# Altium project Audio-Beamformer.PrjPcb (part 2 of 2)

## Sheet Audio-Beamformer_USB_V1.0.SchDoc: Audio-Beamformer
size A4; PageSetup: Record=PageOptions|CenterHorizontal=True|CenterVertical=True|PrintScale=0.97|XCorrection=1.00|YCorrection=1.00|PrintKind=0|BorderSize=5000000|LeftOffset=0|BottomOffset=0|Orientation=2|PaperLength=1000|PaperWidth=1000|Scale=100|PaperSource=7|PrintQuality=-3|MediaType=1|DitherType=10|PrintScaleMode=1|PaperKind=A4|PaperIndex=9; Organization: Ostschweizer Fachhochschule; Address2: Florian Baumgartner & Thierry Schwaller; Address3: florian.baumgartner@ost.ch; DocumentNumber: 7; Revision: V1.0; SheetNumber: 7; SheetTotal: 10; Author: Florian Baumgartner & Thierry Schwaller; Subtitle: USB
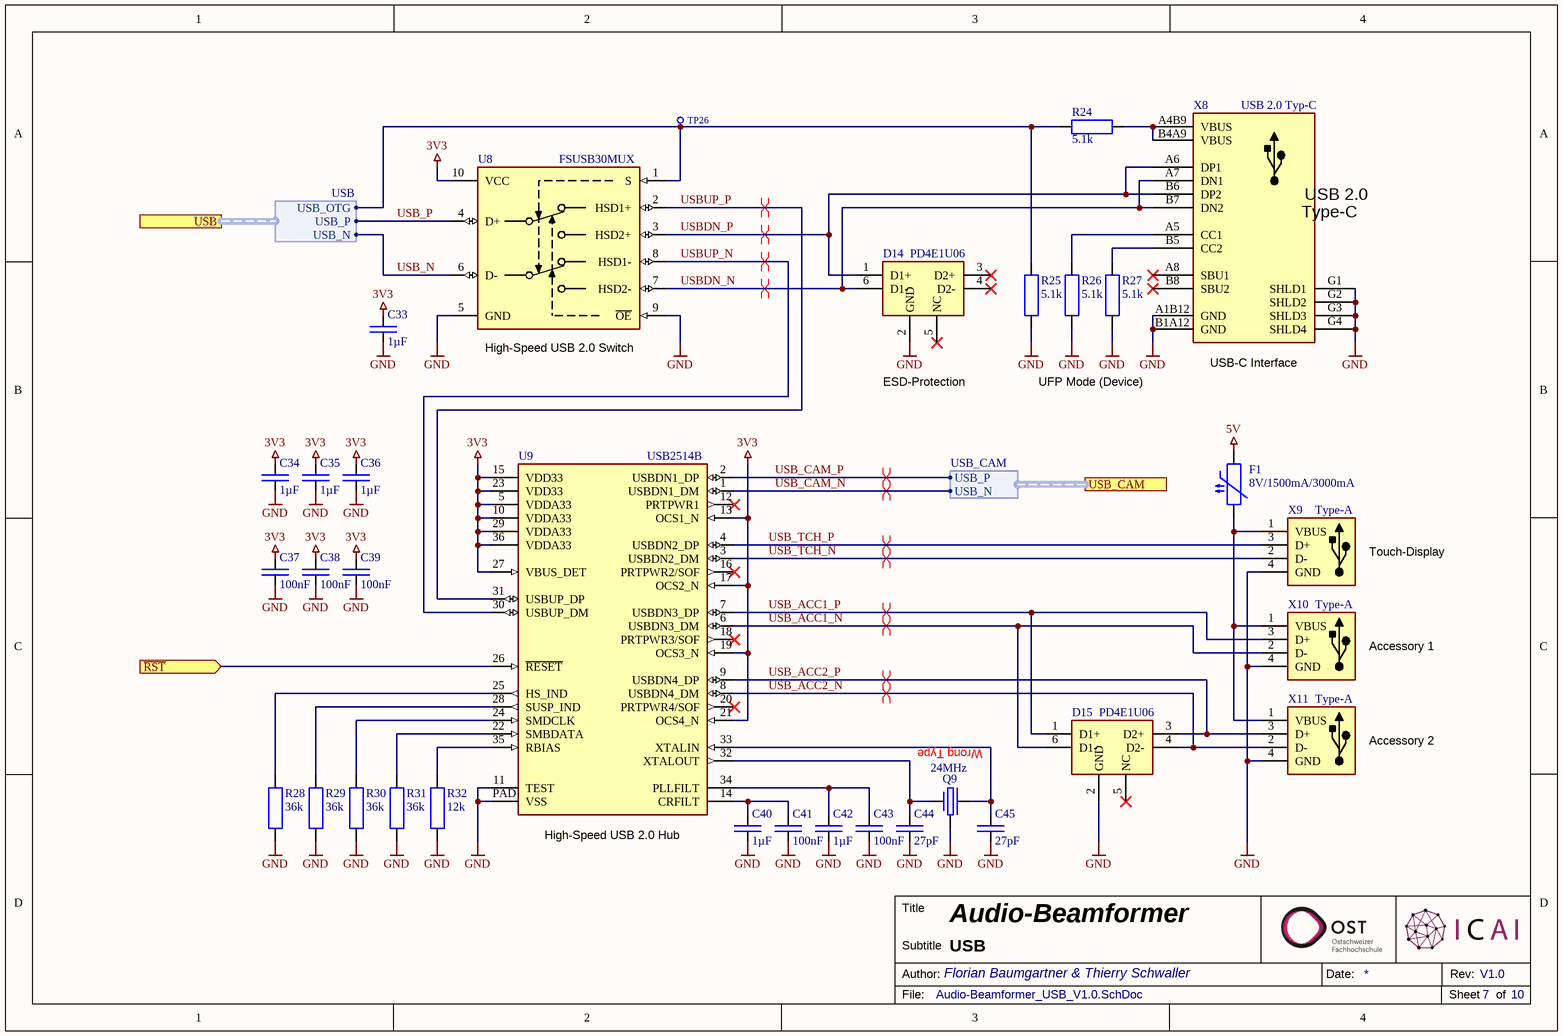
[diagram p5: Audio-Beamformer_USB_V1.0.SchDoc]

### Parts
C33  1µF  [SMD Keramikkondensator 0603]
C34  1µF  [SMD Keramikkondensator 0603]
C35  1µF  [SMD Keramikkondensator 0603]
C36  1µF  [SMD Keramikkondensator 0603]
C37  100nF  [SMD Keramikkondensator 0603]
C38  100nF  [SMD Keramikkondensator 0603]
C39  100nF  [SMD Keramikkondensator 0603]
C40  1µF  [SMD Keramikkondensator 0603]
C41  100nF  [SMD Keramikkondensator 0603]
C42  1µF  [SMD Keramikkondensator 0603]
C43  100nF  [SMD Keramikkondensator 0603]
C44  27pF  [SMD Keramikkondensator 0603]
C45  27pF  [SMD Keramikkondensator 0603]
D14  PD4E1U06  [SMD IC SOT-363 (SC-70-6)]
D15  PD4E1U06  [SMD IC SOT-363 (SC-70-6)]
F1  8V/1500mA/3000mA  [SMD PPTC-Fuse 1206]
Q9  24MHz  [SMD Crystal 3.2X2.5X0.8]
R24  5.1k  [SMD Widerstand 0603]
R25  5.1k  [SMD Widerstand 0603]
R26  5.1k  [SMD Widerstand 0603]
R27  5.1k  [SMD Widerstand 0603]
R28  36k  [SMD Widerstand 0603]
R29  36k  [SMD Widerstand 0603]
R30  36k  [SMD Widerstand 0603]
R31  36k  [SMD Widerstand 0603]
R32  12k  [SMD Widerstand 0603]
TP26  X-TP  [THT Testpunkt Ø1mm]  (value not drawn)  (no BOM)
U8  FSUSB30MUX  [SMD IC MSOP-10]
U9  USB2514B  [SMD IC VFQFN-36]
X8  USB 2.0 Typ-C  [SMD USB-C Socket (A40-00119)]
X9  Type-A  [THT USB-A (292303-1)]
X10  Type-A  [THT USB-A (292303-1)]
X11  Type-A  [THT USB-A (292303-1)]

### Ports
USB (harness USB), USB_CAM (harness USB_CAM), ~{RST} (in)

### Harnesses
USB_CAM: USB_N, USB_P
USB: USB_N, USB_P, USB_OTG

### Nets
3V3: C33.2 C34.2 C35.2 C36.2 C37.2 C38.2 C39.2 U8.10(VCC) U9.5(VDDA33) U9.10(VDDA33) U9.13(OCS1_N) U9.15(VDD33) U9.17(OCS2_N) U9.19(OCS3_N) U9.21(OCS4_N) U9.23(VDD33) U9.27(VBUS_DET) U9.29(VDDA33) U9.36(VDDA33)  [project net A17]
5V: F1.2
GND: C33.1 C34.1 C35.1 C36.1 C37.1 C38.1 C39.1 C40.1 C41.1 C42.1 C43.1 C44.2 C45.2 D14.2(GND) D15.2(GND) Q9.3 R25.2 R26.2 R27.2 R28.1 R29.1 R30.1 R31.1 R32.1 U8.5(GND) U8.9(~{OE}) U9.11(TEST) U9.PAD(VSS) X8.A1B12(GND) X8.B1A12(GND) X8.G1(SHLD1) X8.G2(SHLD2) X8.G3(SHLD3) X8.G4(SHLD4) X9.4(GND) X10.4(GND) X11.4(GND)  [project net A14]
D39: U9.26(~{RESET}) ; port ~{RST}
USB_ACC1_N: D15.6(D1-) U9.6(USBDN3_DM) X10.2(D-)
USB_ACC1_P: D15.1(D1+) U9.7(USBDN3_DP) X10.3(D+)
USB_ACC2_N: D15.4(D2-) U9.8(USBDN4_DM) X11.2(D-)
USB_ACC2_P: D15.3(D2+) U9.9(USBDN4_DP) X11.3(D+)
USB_CAM_N: U9.1(USBDN1_DM) ; port USB_CAM.USB_N
USB_CAM_P: U9.2(USBDN1_DP) ; port USB_CAM.USB_P
USB_N: U8.6(D-) ; port USB.USB_N
USB_OTG: R24.1 R25.1 TP26.1 U8.1(NC) ; port USB.USB_OTG
USB_P: U8.4(D+) ; port USB.USB_P
USB_TCH_N: U9.3(USBDN2_DM) X9.2(D-)
USB_TCH_P: U9.4(USBDN2_DP) X9.3(D+)
USBDN_N: D14.6(D1-) U8.7(HSD2-) X8.A7(DN1) X8.B7(DN2)
USBDN_P: D14.1(D1+) U8.3(HSD2+) X8.A6(DP1) X8.B6(DP2)
USBUP_N: U8.8(HSD1-) U9.30(USBUP_DM)
USBUP_P: U8.2(HSD1+) U9.31(USBUP_DP)
NetC40_2: C40.2 C41.2 U9.14(CRFILT)
NetC42_2: C42.2 C43.2 U9.34(PLLFILT)
NetC44_1: C44.1 Q9.1 U9.32(XTALOUT)
NetC45_1: C45.1 Q9.2 U9.33(XTALIN)
NetF1_1: F1.1 X9.1(VBUS) X10.1(VBUS) X11.1(VBUS)
NetR24_2: R24.2 X8.A4B9(VBUS) X8.B4A9(VBUS)
NetR26_1: R26.1 X8.A5(CC1)
NetR27_1: R27.1 X8.B5(CC2)
NetR28_2: R28.2 U9.25(HS_IND)
NetR29_2: R29.2 U9.28(SUSP_IND)
NetR30_2: R30.2 U9.24(SMDCLK)
NetR31_2: R31.2 U9.22(SMBDATA)
NetR32_2: R32.2 U9.35(RBIAS)

Not connected (* = marked no-connect by the designer): D14 3(D2+)* 4(D2-)* 5(NC)*; D15 5(NC)*; U9 12(PRTPWR1)* 16(PRTPWR2/SOF)* 18(PRTPWR3/SOF)* 20(PRTPWR4/SOF)*; X8 A8(SBU1)* B8(SBU2)*

### Layout directives
differential pair: USB_ACC1_N, USB_ACC1_P, USB_ACC2_N, USB_ACC2_P, USB_CAM_N, USB_CAM_P, USB_TCH_N, USB_TCH_P, USBDN_N, USBDN_P, USBUP_N, USBUP_P

### Notes on the sheet
- (near U8) High-Speed USB 2.0 Switch
- ESD-Protection
- UFP Mode (Device)
- (near X8) USB-C Interface
- Touch-Display
- Accessory 1
- (near Q9) Wrong Type
- Accessory 2
- (near U9) High-Speed USB 2.0 Hub
- Title
- Author:
- Subtitle
- Date:
- Rev:
- File:
- Sheet
- of
- (in symbol X-USB-Buchse) USB 2.0; Type-C

### Library data of the parts
C33-C36 C40 C42 = E6 - 1uF: SMD Ceramic Capacitor E6; Component Value: 1µF 50V; Component Description: Multilayer Ceramic Capacitors MLCC; ComponentLink1Description: Datasheet; ComponentLink1URL: https://datasheet.lcsc.com/lcsc/1810261812_Samsung-Electro-Mechanics-CL10A105KB8NNNC_C15849.pdf; Digikey: 1276-1860-1-ND; Farnell: 3013383; JLC-Parts: C15849; Mouser: 187-CL10A105KB8NNNC; Unit Price: 0.01
C37-C39 C41 C43 = C-CAPACITOR: CAP-MK; Component Description: Multilayer Ceramic Capacitors; Component Value: 100nF 50V; Digikey: 445-5666-1-ND; Farnell: 2522432; Mouser: 77-VJ0603V104ZXAPBC; JLC-Parts: C14663; Unit Price: 0.01
C44 C45 = C-CAPACITOR: CAP-MK; Component Description: Multilayer Ceramic Capacitors; Component Value: 27pF 50V; Digikey: 399-C0603C270J5GAC7867CT-ND; Farnell: 1414627; Mouser: 80-C0603C270J5G; JLC-Parts: C1656; Unit Price: 0.01
D14 D15 = PD4E1U06DCKR: Unidirectional 3A (8/20us) 15V (Typ) 6.5V 5.5V (Max) SOT-363 ESD Protection Devices ROHS; Component Description: ESD Suppressor; ComponentLink1Description: Datasheet; ComponentLink1URL: https://datasheet.lcsc.com/lcsc/1810172210_Texas-Instruments-TPD4E1U06DCKR_C194628.pdf; Component Value: PD4E1U06; Digikey: 296-39347-1-ND; Farnell: 3116516; JLC-Parts: C194628; Mouser: 595-TPD4E1U06DCKR; Unit Price: 0.12
F1 = nSMD020-30V: 8V/1500mA/3000mA Resettable Fuses; Component Value: 8V/1500mA/3000mA/100ms; Component Description: PTC Resettable Fuse; ComponentLink1Description: Datasheet; ComponentLink1URL: https://www.littelfuse.com/~/media/electronics/datasheets/resettable_ptcs/littelfuse_ptc_1206l_datasheet.pdf.pdf; Digikey: F3372CT-ND; Farnell: 2383296; JLC-Parts: C118413; Mouser: 576-1206L150THWR; Unit Price: 0.07
Q9 = B-QUARZ-CAP: Component Description: Crystal; Digikey: XC2310CT-ND; Farnell: 3649756; Mouser: 520-240-18-33-JGNT; ComponentLink1Description: Datasheet; ComponentLink1URL: https://datasheet.lcsc.com/lcsc/1810170919_TKD-SX32Y024000BC1T_C271629.pdf; Component Value: 24Mhz; JLC-Parts: C271629; Unit Price: 0.11
R24-R27 = R-RESISTOR: RES (E=Heizwiderstand B=Messwandler); Component Description: Thick Film Chip Resistor; Component Value: 5.1k (75V, 100mW, 1%); Digikey: P5.10KHCT-ND; Farnell: 2059378; Mouser: 667-ERJ-3EKF5101V; JLC-Parts: C23186; Unit Price: 0.01
R28-R31 = R-RESISTOR: RES (E=Heizwiderstand B=Messwandler); Component Description: Thick Film Chip Resistor; Component Value: 36k (75V, 100mW, 1%); Digikey: P36.0KHCT-ND; Farnell: 2303207; Mouser: 667-ERJ-3EKF3602V; JLC-Parts: C23147; Unit Price: 0.01
R32 = R-RESISTOR: RES (E=Heizwiderstand B=Messwandler); Component Description: Thick Film Chip Resistor; Component Value: 12k (75V, 100mW, 1%); Digikey: P12.0KHCT-ND; Farnell: 2303195; Mouser: 667-ERJ-3EKF1202V; JLC-Parts: C22790; Unit Price: 0.01
TP26 = X-TP: Testpunkt; Component Description: Testpoint; Component Value: Ø 0.8mm; Unit Price: 0.00
U8 = U-FSUSB30MUX: High Speed USB 2.0 Switch; Digikey: FSUSB30MUXCT-ND; Farnell: 1495465; Mouser: 512-FSUSB30MUX; Component Description: High Speed USB 2.0 Switch; ComponentLink1Description: Datasheet; ComponentLink1URL: https://datasheet.lcsc.com/lcsc/1809111813_onsemi-FSUSB30MUX_C11143.pdf; Component Value: FSUSB30MUX; JLC-Parts: C11143; Unit Price: 0.41
U9 = U-USB2514B: USB 2.0 Hi-Speed Hub Controller; Component Value: USB2514B-AEZC-TR; Digikey: USB2514B-AEZC-CT-ND; Farnell: 2775061; Mouser: 886-USB2514B-AEZC-TR; Component Description: USB 2.0 Hi-Speed Hub Controller; ComponentLink1Description: Datasheet; ComponentLink1URL: https://datasheet.lcsc.com/lcsc/1809200030_Microchip-Tech-USB2514B-AEZC-TR_C16251.pdf; JLC-Parts: C16251; Unit Price: 6.37
X8 = X-USB-Buchse: Typ-C; aliExpress: 33045191307; Component Description: USB Connector Type-C; Component Value: USB4105-GF-A; Digikey: 2073-USB4105-GF-ACT-ND; Farnell: 3583366; ComponentLink1Description: Datasheet; ComponentLink1URL: https://datasheet.lcsc.com/lcsc/2103051833_Jing-Extension-of-the-Electronic-Co--918-418K2023S40001_C167321.pdf; JLC-Parts: C167321; Unit Price: 0.34
X9-X11 = X-USB-Type-A: Component Value: 292303-1; Component Description: USB Connector Type-A; Digikey: A31726-ND; Farnell: 1076663; Mouser: 571-292303-1; Unit Price: 0.45; ComponentLink1Description: Datasheet; ComponentLink1URL: https://datasheet.lcsc.com/lcsc/1811131820_TE-Connectivity-292303-1_C86461.pdf; JLC-Parts: C86461

## Sheet Audio-Beamformer_HDMI_V1.0.SchDoc: Audio-Beamformer
size A4; PageSetup: Record=PageOptions|CenterHorizontal=True|CenterVertical=True|PrintScale=0.97|XCorrection=1.00|YCorrection=1.00|PrintKind=0|BorderSize=5000000|LeftOffset=0|BottomOffset=0|Orientation=2|PaperLength=1000|PaperWidth=1000|Scale=100|PaperSource=7|PrintQuality=-3|MediaType=1|DitherType=10|PrintScaleMode=1|PaperKind=A4|PaperIndex=9; Organization: Ostschweizer Fachhochschule; Address2: Florian Baumgartner & Thierry Schwaller; Address3: florian.baumgartner@ost.ch; DocumentNumber: 6; Revision: V1.0; SheetNumber: 6; SheetTotal: 10; Author: Florian Baumgartner & Thierry Schwaller; Subtitle: HDMI
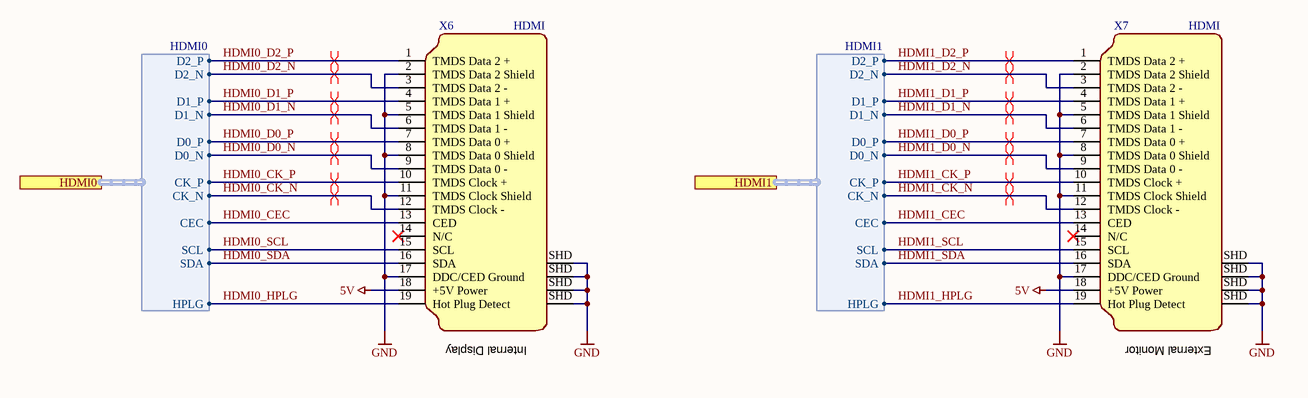
[diagram p6: Audio-Beamformer_HDMI_V1.0.SchDoc]

### Parts
X6  HDMI  [SMD HDMI Horizontal]
X7  HDMI  [SMD HDMI Horizontal]

### Ports
HDMI0 (harness HDMI0), HDMI1 (harness HDMI1)

### Harnesses
HDMI1: D2_N, D1_P, D2_P, D1_N, D0_P, D0_N, CK_N, CK_P, CEC, SCL, SDA, HPLG
HDMI0: D2_N, D1_P, D2_P, D1_N, D0_P, D0_N, CK_N, CK_P, CEC, SCL, SDA, HPLG

### Nets
5V: X6.18(+5V_Power) X7.18(+5V_Power)
GND: X6.2(TMDS_Data_2_Shield) X6.5(TMDS_Data_1_Shield) X6.8(TMDS_Data_0_Shield) X6.11(TMDS_Clock_Shield) X6.17(DDC/CED_Ground) X6.SHD X7.2(TMDS_Data_2_Shield) X7.5(TMDS_Data_1_Shield) X7.8(TMDS_Data_0_Shield) X7.11(TMDS_Clock_Shield) X7.17(DDC/CED_Ground) X7.SHD  [project net A14]
HDMI0_CEC: X6.13(CED) ; port HDMI0.CEC
HDMI0_CK_N: X6.12(TMDS_Clock_-) ; port HDMI0.CK_N
HDMI0_CK_P: X6.10(TMDS_Clock_+) ; port HDMI0.CK_P
HDMI0_D0_N: X6.9(TMDS_Data_0_-) ; port HDMI0.D0_N
HDMI0_D0_P: X6.7(TMDS_Data_0_+) ; port HDMI0.D0_P
HDMI0_D1_N: X6.6(TMDS_Data_1_-) ; port HDMI0.D1_N
HDMI0_D1_P: X6.4(TMDS_Data_1_+) ; port HDMI0.D1_P
HDMI0_D2_N: X6.3(TMDS_Data_2_-) ; port HDMI0.D2_N
HDMI0_D2_P: X6.1(TMDS_Data_2_+) ; port HDMI0.D2_P
HDMI0_HPLG: X6.19(Hot_Plug_Detect) ; port HDMI0.HPLG
HDMI0_SCL: X6.15(SCL) ; port HDMI0.SCL
HDMI0_SDA: X6.16(SDA) ; port HDMI0.SDA
HDMI1_CEC: X7.13(CED) ; port HDMI1.CEC
HDMI1_CK_N: X7.12(TMDS_Clock_-) ; port HDMI1.CK_N
HDMI1_CK_P: X7.10(TMDS_Clock_+) ; port HDMI1.CK_P
HDMI1_D0_N: X7.9(TMDS_Data_0_-) ; port HDMI1.D0_N
HDMI1_D0_P: X7.7(TMDS_Data_0_+) ; port HDMI1.D0_P
HDMI1_D1_N: X7.6(TMDS_Data_1_-) ; port HDMI1.D1_N
HDMI1_D1_P: X7.4(TMDS_Data_1_+) ; port HDMI1.D1_P
HDMI1_D2_N: X7.3(TMDS_Data_2_-) ; port HDMI1.D2_N
HDMI1_D2_P: X7.1(TMDS_Data_2_+) ; port HDMI1.D2_P
HDMI1_HPLG: X7.19(Hot_Plug_Detect) ; port HDMI1.HPLG
HDMI1_SCL: X7.15(SCL) ; port HDMI1.SCL
HDMI1_SDA: X7.16(SDA) ; port HDMI1.SDA

Not connected (* = marked no-connect by the designer): X6 14(N/C)*; X7 14(N/C)*

### Layout directives
differential pair: HDMI0_CK_N, HDMI0_CK_P, HDMI0_D0_N, HDMI0_D0_P, HDMI0_D1_N, HDMI0_D1_P, HDMI0_D2_N, HDMI0_D2_P, HDMI1_CK_N, HDMI1_CK_P, HDMI1_D0_N, HDMI1_D0_P, HDMI1_D1_N, HDMI1_D1_P, HDMI1_D2_N, HDMI1_D2_P

### Notes on the sheet
- (near X6) Internal Display
- (near X7) External Monitor
- Title
- Author:
- Subtitle
- Date:
- Rev:
- File:
- Sheet
- of

### Library data of the parts
X6 X7 = X-HDMI-Connector: Female Right Angle; Component Description: HDMI-Connector (Female Right Angle); Component Value: HDMR-19-01-S-SM; Digikey: SAM9475-ND; Farnell: 3742389; Mouser: 200-HDMR-19-01-SSMTR; ComponentLink1Description: Datasheet; ComponentLink1URL: https://datasheet.lcsc.com/lcsc/1811111311_BOOMELE-Boom-Precision-Elec-C138388_C138388.pdf; JLC-Parts: C138388; Unit Price: 0.21

## Sheet Audio-Beamformer_Sensors_V1.0.SchDoc: Audio-Beamformer
size A4; PageSetup: Record=PageOptions|CenterHorizontal=True|CenterVertical=True|PrintScale=0.97|XCorrection=1.00|YCorrection=1.00|PrintKind=0|BorderSize=5000000|LeftOffset=0|BottomOffset=0|Orientation=2|PaperLength=1000|PaperWidth=1000|Scale=100|PaperSource=7|PrintQuality=-3|MediaType=1|DitherType=10|PrintScaleMode=1|PaperKind=A4|PaperIndex=9; Organization: Ostschweizer Fachhochschule; Address2: Florian Baumgartner & Thierry Schwaller; Address3: florian.baumgartner@ost.ch; DocumentNumber: 10; Revision: V1.0; SheetNumber: 10; SheetTotal: 10; Author: Florian Baumgartner & Thierry Schwaller; Subtitle: Sensors
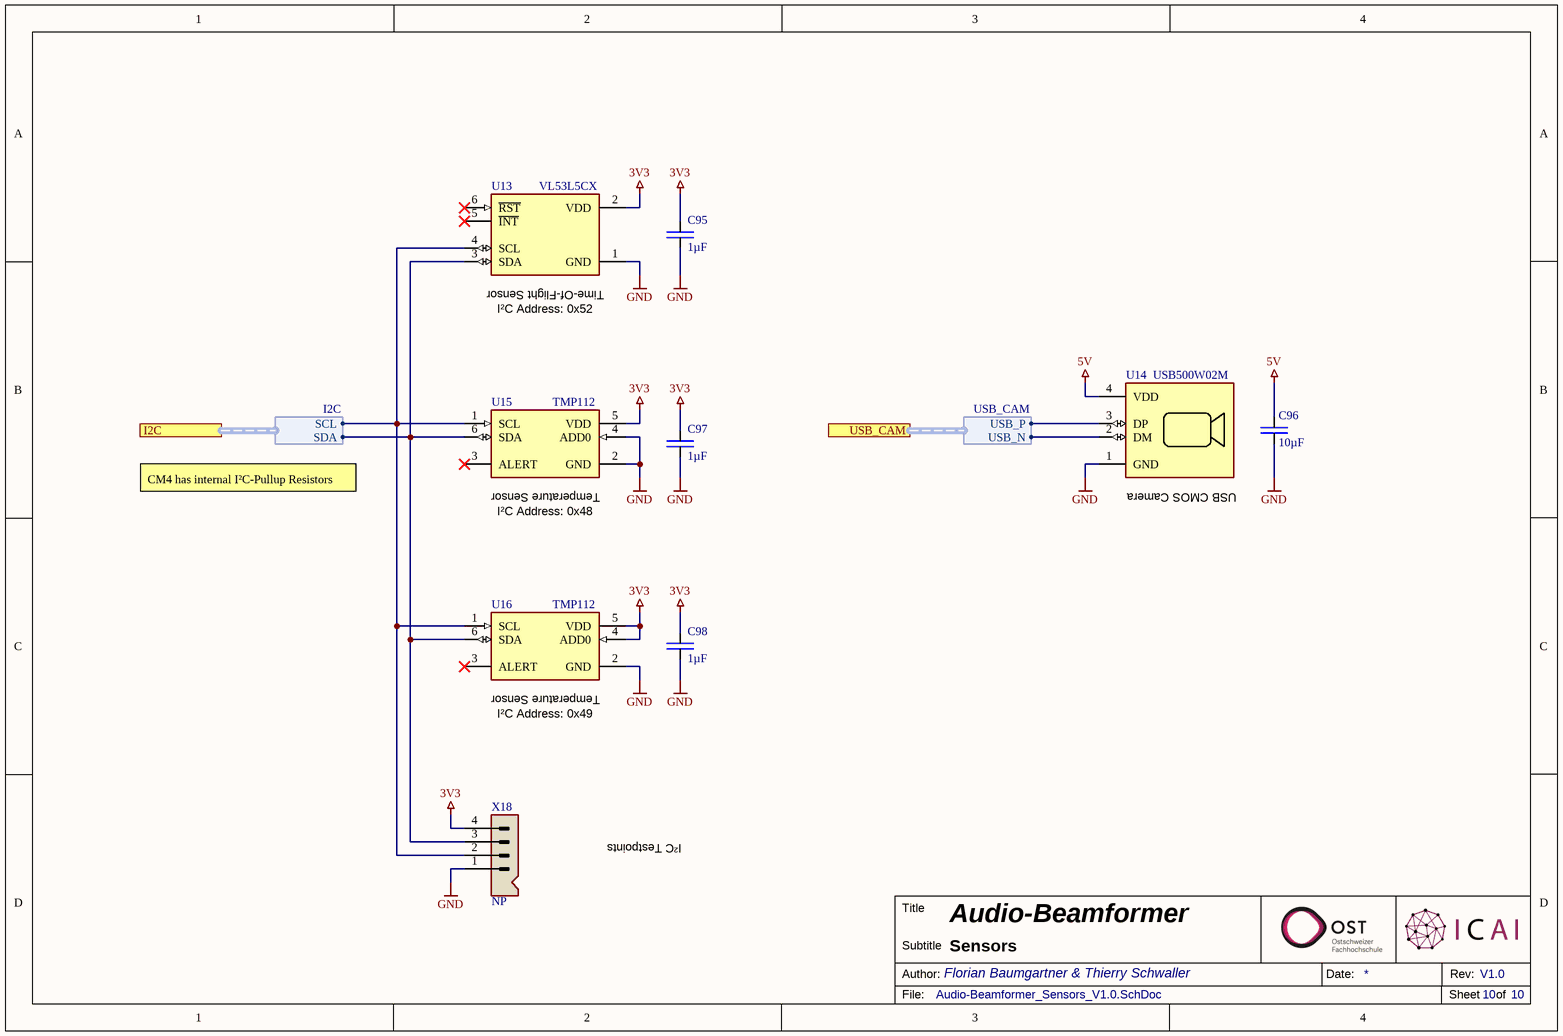
[diagram p7: Audio-Beamformer_Sensors_V1.0.SchDoc]

### Parts
C95  1µF  [SMD Keramikkondensator 0603]
C96  10µF  [SMD Keramikkondensator 1206]
C97  1µF  [SMD Keramikkondensator 0603]
C98  1µF  [SMD Keramikkondensator 0603]
U13  VL53L5CX  [THT ToF-Sensor (VL53L5CX)]
U14  USB500W02M  [THT Camera (USB500W02M)]
U15  TMP112  [SMD IC SOT-563]
U16  TMP112  [SMD IC SOT-563]
X18  NP  [THT Pin-Header 4x1 (NP)]

### Ports
I2C (harness I2C), USB_CAM (harness USB_CAM)

### Harnesses
I2C: SCL, SDA
USB_CAM: USB_N, USB_P

### Nets
3V3: C95.2 C97.2 C98.2 U13.2(VDD) U15.5(VDD) U16.4(ADD0) U16.5(VDD) X18.4  [project net A17]
5V: C96.2 U14.4(VDD)
GND: C95.1 C96.1 C97.1 C98.1 U13.1(GND) U14.1(GND) U15.2(GND) U15.4(ADD0) U16.2(GND) X18.1  [project net A14]
USB_CAM_N: U14.2(DM) ; port USB_CAM.USB_N
USB_CAM_P: U14.3(DP) ; port USB_CAM.USB_P
NetU5_80: U13.4(SCL) U15.1(SCL) U16.1(SCL) X18.2 ; port I2C.SCL
NetU5_82: U13.3(SDA) U15.6(SDA) U16.6(SDA) X18.3 ; port I2C.SDA

Not connected (* = marked no-connect by the designer): U13 5(~{INT})* 6(~{RST})*; U15 3(ALERT)*; U16 3(ALERT)*

### Notes on the sheet
- (near U13) Time-Of-Flight Sensor
- (near U13) I²C Address: 0x52
- CM4 has internal I²C-Pullup Resistors
- (near U15) Temperature Sensor
- (near U15) I²C Address: 0x48
- (near U14) USB CMOS Camera
- (near U16) Temperature Sensor
- (near U16) I²C Address: 0x49
- (near X18) I²C Testpoints
- Title
- Author:
- Subtitle
- Date:
- Rev:
- File:
- Sheet
- of

### Library data of the parts
C95 C97 C98 = C-CAPACITOR: CAP-MK; Component Description: Multilayer Ceramic Capacitors; Component Value: 1µF 16V; Digikey: 587-1251-1-ND; Farnell: 1327680; Mouser: 963-EMK107BJ105KA-T; JLC-Parts: C15849; Unit Price: 0.01
C96 = C-CAPACITOR: as C2 on sheet Audio-Beamformer_Supply_V1.0; Digikey: 445-7886-1-ND; Farnell: 2211092; Mouser: 810-CGA5L3X5R1H106K; JLC-Parts: C13585; Unit Price: 0.27
U13 = U-VL53L5CX: Time-of-Flight 8x8 Multizone Sensor; ComponentLink1Description: Datasheet; ComponentLink1URL: https://www.st.com/resource/en/datasheet/vl53l5cx.pdf; Digikey: 1568-SEN-19013-ND; Component Value: VL53L5CX; Mouser: 474-SEN-19013; Unit Price: 22.95; Component Description: Time-of-Flight 8x8 Multizone Sensor
U14 = U-USB500W02M: USB 5.0 Megapixel CMOS Camera Module; ComponentLink1Description: Datasheet; ComponentLink1URL: http://chinavasion.cn/upfile/2017/11/17/20171117105421_537.pdf; Component Description: USB 5.0 Megapixel CMOS Camera Module; Component Value: USB500W02M; Unit Price: 40.00
U15 U16 = U-TMP112AIDRLR: High-Accuracy, Low-Power, Digital Temperature Sensor; Digikey: 296-38578-1-ND; Farnell: 3009067; JLC-Parts: C28927; Mouser: 595-TMP112AIDRLR; ComponentLink1Description: Datasheet; ComponentLink1URL: https://www.ti.com/general/docs/suppproductinfo.tsp?distId=10&gotoUrl=https%3A%2F%2Fwww.ti.com%2Flit%2Fgpn%2Ftmp112; Component Description: High-Accuracy, Low-Power, Digital Temperature Sensor; Component Value: TMP112AIDRLR; Unit Price: 1.79
X18 = X-Stiftleiste (4-Fach): Component Description: Pin Header; Unit Price: 0.00

## Sheet Audio-Beamformer_FPGA_V1.0.SchDoc: Audio-Beamformer
size A4; PageSetup: Record=PageOptions|CenterHorizontal=True|CenterVertical=True|PrintScale=0.97|XCorrection=1.00|YCorrection=1.00|PrintKind=0|BorderSize=5000000|LeftOffset=0|BottomOffset=0|Orientation=2|PaperLength=1000|PaperWidth=1000|Scale=100|PaperSource=7|PrintQuality=-3|MediaType=1|DitherType=10|PrintScaleMode=1|PaperKind=A4|PaperIndex=9; Organization: Ostschweizer Fachhochschule; Address2: Florian Baumgartner & Thierry Schwaller; Address3: florian.baumgartner@ost.ch; DocumentNumber: 4; Revision: V1.0; SheetNumber: 4; SheetTotal: 10; Author: Florian Baumgartner & Thierry Schwaller; Subtitle: FPGA
Used 2 times, as channels FPGA, FPGA. Parts and nets are listed once, with the designators drawn on the sheet.
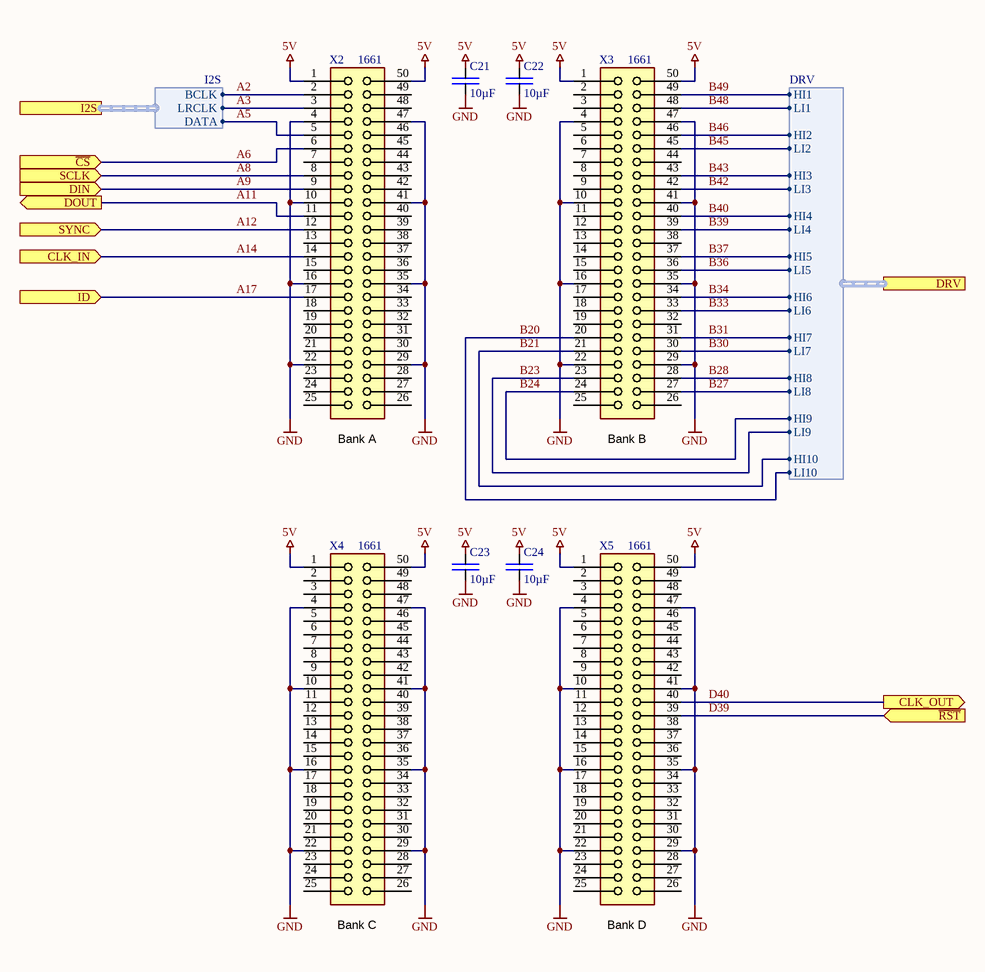
[diagram p8: Audio-Beamformer_FPGA_V1.0.SchDoc]

### Parts
C21  10µF  [SMD Keramikkondensator 1206]
C22  10µF  [SMD Keramikkondensator 1206]
C23  10µF  [SMD Keramikkondensator 1206]
C24  10µF  [SMD Keramikkondensator 1206]
X2  1661  [SMD Connector (1661)]
X3  1661  [SMD Connector (1661)]
X4  1661  [SMD Connector (1661)]
X5  1661  [SMD Connector (1661)]

### Ports
CLK_IN (in), CLK_OUT (out), DIN (in), DOUT (out), DRV (harness DRV), I2S (harness I2S), ID (in), SCLK (in), SYNC (in), ~{CS} (in), ~{RST} (in)

### Harnesses
I2S: BCLK, LRCLK, DATA
DRV: LI1, LI2, LI3, LI4, LI5, LI6, LI7, LI8, LI9, LI10, HI1, HI2, HI3, HI4, HI5, HI6, HI7, HI8, HI9, HI10

### Nets
5V: C21.2 C22.2 C23.2 C24.2 X2.1 X2.50 X3.1 X3.50 X4.1 X4.50 X5.1 X5.50
GND: C21.1 C22.1 C23.1 C24.1 X2.4 X2.10 X2.16 X2.22 X2.29 X2.35 X2.41 X2.47 X3.4 X3.10 X3.16 X3.22 X3.29 X3.35 X3.41 X3.47 X4.4 X4.10 X4.16 X4.22 X4.29 X4.35 X4.41 X4.47 X5.4 X5.10 X5.16 X5.22 X5.29 X5.35 X5.41 X5.47
A2: X2.2 ; port I2S.BCLK
A3: X2.3 ; port I2S.LRCLK
A5: X2.5 ; port I2S.DATA
A6: X2.6 ; port ~{CS}
A8: X2.8 ; port SCLK
A9: X2.9 ; port DIN
A11: X2.11 ; port DOUT
A12: X2.12 ; port SYNC
A14: X2.14 ; port CLK_IN
A17: X2.17 ; port ID
B20: X3.20 ; port DRV.LI10
B21: X3.21 ; port DRV.HI10
B23: X3.23 ; port DRV.LI9
B24: X3.24 ; port DRV.HI9
B27: X3.27 ; port DRV.LI8
B28: X3.28 ; port DRV.HI8
B30: X3.30 ; port DRV.LI7
B31: X3.31 ; port DRV.HI7
B33: X3.33 ; port DRV.LI6
B34: X3.34 ; port DRV.HI6
B36: X3.36 ; port DRV.LI5
B37: X3.37 ; port DRV.HI5
B39: X3.39 ; port DRV.LI4
B40: X3.40 ; port DRV.HI4
B42: X3.42 ; port DRV.LI3
B43: X3.43 ; port DRV.HI3
B45: X3.45 ; port DRV.LI2
B46: X3.46 ; port DRV.HI2
B48: X3.48 ; port DRV.LI1
B49: X3.49 ; port DRV.HI1
D39: X5.39 ; port ~{RST}
D40: X5.40 ; port CLK_OUT

Not connected (* = marked no-connect by the designer): X2 7 13 15 18 19 20 21 23 24 25 26 27 28 30 31 32 33 34 36 37 38 39 40 42 43 44 45 46 48 49; X3 2 3 5 6 7 8 9 11 12 13 14 15 17 18 19 25 26 32 38 44; X4 2 3 5 6 7 8 9 11 12 13 14 15 17 18 19 20 21 23 24 25 26 27 28 30 31 32 33 34 36 37 38 39 40 42 43 44 45 46 48 49; X5 2 3 5 6 7 8 9 11 12 13 14 15 17 18 19 20 21 23 24 25 26 27 28 30 31 32 33 34 36 37 38 42 43 44 45 46 48 49

### Channels
FPGA: designators end in _1; ports CLK_IN=A14 CLK_OUT=D40 DIN=A9 DOUT=A11 ID=A14 SCLK=A8 SYNC=A12 ~{CS}=A6 ~{RST}=D39
FPGA: designators end in _2; ports CLK_IN=A14 CLK_OUT=D40 DIN=A11 DOUT=A11 ID=A17 SCLK=A8 SYNC=A12 ~{CS}=A6 ~{RST}=D39

### Notes on the sheet
- (near X2) Bank A
- (near X3) Bank B
- (near X4) Bank C
- (near X5) Bank D
- Title
- Author:
- Subtitle
- Date:
- Rev:
- File:
- Sheet
- of

### Library data of the parts
C21-C24 = C-CAPACITOR: CAP-MK; Component Description: Multilayer Ceramic Capacitors; Component Value: 10µF 50V; Digikey: 445-7886-1-ND; Farnell: 2211092; Mouser: 810-CGA5L3X5R1H106K; JLC-Parts: C13585; Unit Price: 0.27
X2-X5 = X-4UCON_1661: Board-to-Board Connector (Receptacle); Component Value: PRT-16890 (1661); Digikey: 1568-PRT-16890-ND; Mouser: 474-PRT-16890; ComponentLink1Description: Datasheet; ComponentLink1URL: http://www.4uconnector.com/online/object/4udrawing/19008.pdf; Component Description: Board-to-Board Connector (Receptacle); Unit Price: 1.60

## Sheet Audio-Beamformer_HMI_V1.0.SchDoc: Audio-Beamformer
size A4; PageSetup: Record=PageOptions|CenterHorizontal=True|CenterVertical=True|PrintScale=0.97|XCorrection=1.00|YCorrection=1.00|PrintKind=0|BorderSize=5000000|LeftOffset=0|BottomOffset=0|Orientation=2|PaperLength=1000|PaperWidth=1000|Scale=100|PaperSource=7|PrintQuality=-3|MediaType=1|DitherType=10|PrintScaleMode=1|PaperKind=A4|PaperIndex=9; Organization: Ostschweizer Fachhochschule; Address2: Florian Baumgartner & Thierry Schwaller; Address3: florian.baumgartner@ost.ch; DocumentNumber: 8; Revision: V1.0; SheetNumber: 8; SheetTotal: 10; Author: Florian Baumgartner & Thierry Schwaller; Subtitle: HMI
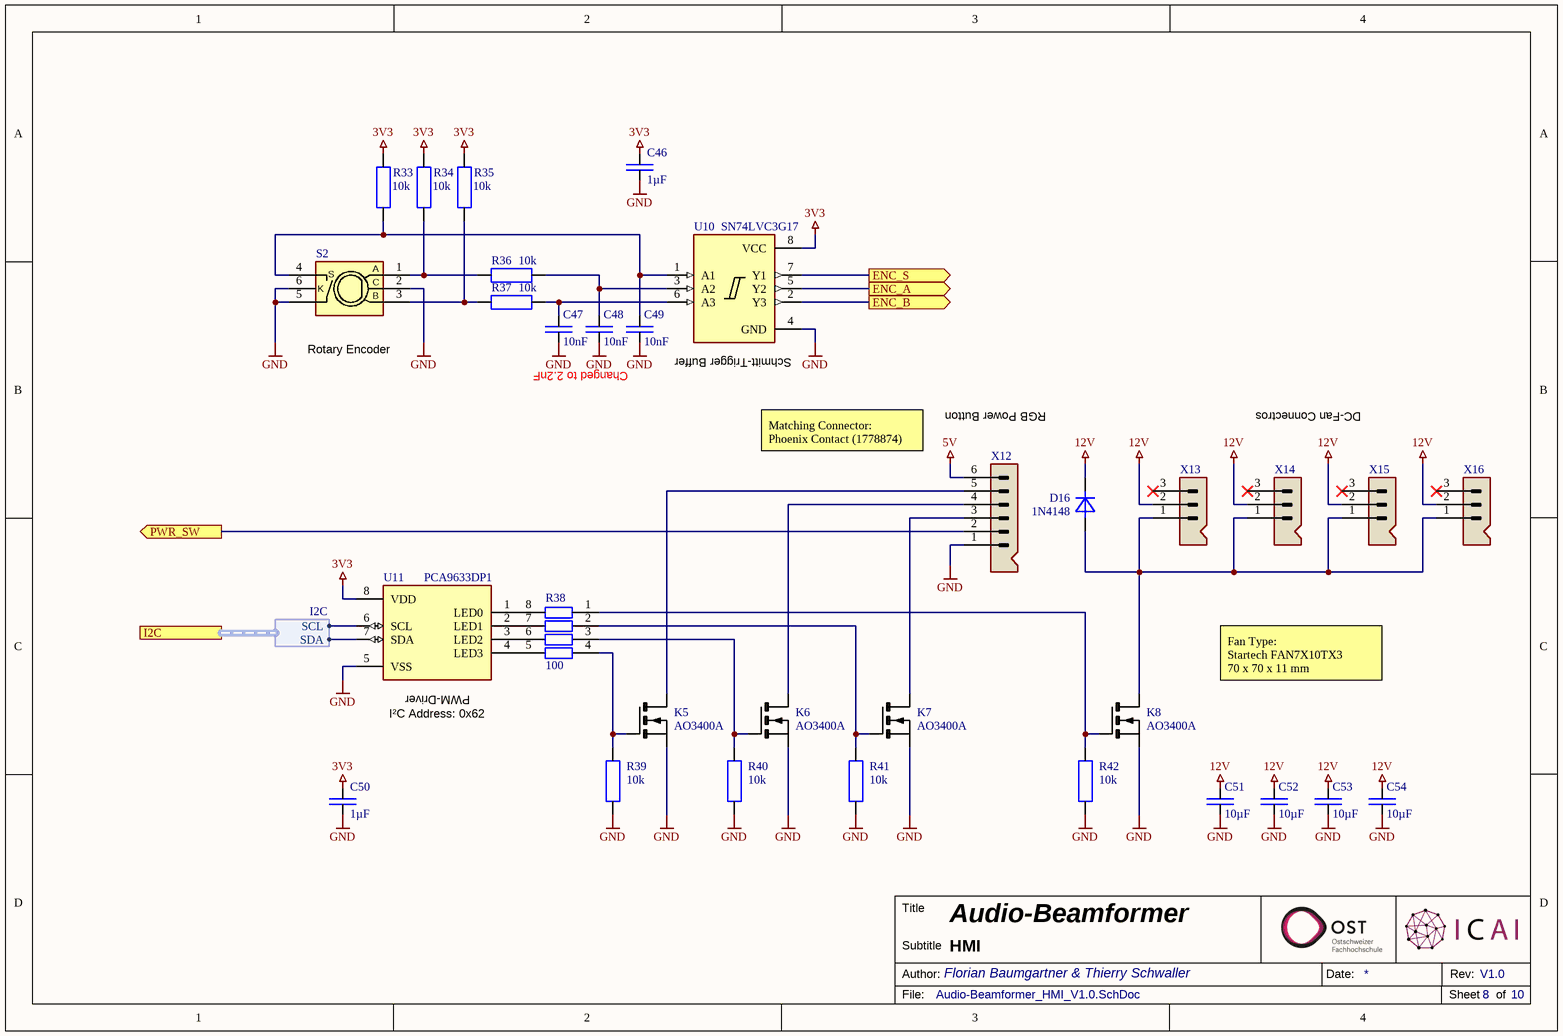
[diagram p9: Audio-Beamformer_HMI_V1.0.SchDoc]

### Parts
C46  1µF  [SMD Keramikkondensator 0603]
C47  10nF  [SMD Keramikkondensator 0603]
C48  10nF  [SMD Keramikkondensator 0603]
C49  10nF  [SMD Keramikkondensator 0603]
C50  1µF  [SMD Keramikkondensator 0603]
C51  10µF  [SMD Keramikkondensator 1206]
C52  10µF  [SMD Keramikkondensator 1206]
C53  10µF  [SMD Keramikkondensator 1206]
C54  10µF  [SMD Keramikkondensator 1206]
D16  1N4148  [SMD Diode SOD-123]
K5  AO3400A  [SMD MOSFET SOT-23]
K6  AO3400A  [SMD MOSFET SOT-23]
K7  AO3400A  [SMD MOSFET SOT-23]
K8  AO3400A  [SMD MOSFET SOT-23]
R33  10k  [SMD Widerstand 0603]
R34  10k  [SMD Widerstand 0603]
R35  10k  [SMD Widerstand 0603]
R36  10k  [SMD Widerstand 0603]
R37  10k  [SMD Widerstand 0603]
R38  100  [SMD Widerstand Array 4-Fach 0603]
R39  10k  [SMD Widerstand 0603]
R40  10k  [SMD Widerstand 0603]
R41  10k  [SMD Widerstand 0603]
R42  10k  [SMD Widerstand 0603]
S2  PEC11R-4025F-S0024  [THT Rotary Encoder with Switch]  (value not drawn)
U10  SN74LVC3G17  [SMD IC SM-8]
U11  PCA9633DP1  [SMD IC TSSOP-8]
X12  Board-To-Wire Connector (Receptacle)  [THT Connector 2.5mm 6-Pol (1778667)]  (value not drawn)
X13  Stiftleiste (3-Fach)  [THT Connector 2.54mm 3-Pol (61900311021)]  (value not drawn)
X14  Stiftleiste (3-Fach)  [THT Connector 2.54mm 3-Pol (61900311021)]  (value not drawn)
X15  Stiftleiste (3-Fach)  [THT Connector 2.54mm 3-Pol (61900311021)]  (value not drawn)
X16  Stiftleiste (3-Fach)  [THT Connector 2.54mm 3-Pol (61900311021)]  (value not drawn)

### Ports
ENC_A (out), ENC_B (out), ENC_S (out), I2C (harness I2C), PWR_SW (out)

### Harnesses
I2C: SCL, SDA

### Nets
3V3: C46.2 C50.2 R33.2 R34.2 R35.2 U10.8(VCC) U11.8(VDD)  [project net A17]
5V: X12.6
12V: C51.2 C52.2 C53.2 C54.2 D16.K X13.2 X14.2 X15.2 X16.2
GND: C46.1 C47.1 C48.1 C49.1 C50.1 C51.1 C52.1 C53.1 C54.1 K5.S K6.S K7.S K8.S R39.1 R40.1 R41.1 R42.1 S2.2(C) S2.5(S) S2.6(K) U10.4(GND) U11.5(VSS) X12.1  [project net A14]
ENC_A: U10.5(Y2) ; port ENC_A
ENC_B: U10.2(Y3) ; port ENC_B
ENC_S: U10.7(Y1) ; port ENC_S
PWR_SW: X12.2 ; port PWR_SW
NetC47_2: C47.2 R37.1 U10.6(A3)
NetC48_2: C48.2 R36.1 U10.3(A2)
NetC49_2: C49.2 R33.1 S2.4(S) U10.1(A1)
NetD16_A: D16.A K8.D X13.1 X14.1 X15.1 X16.1
NetK5_D: K5.D X12.5
NetK5_G: K5.G R38.4 R39.2
NetK6_D: K6.D X12.4
NetK6_G: K6.G R38.3 R40.2
NetK7_D: K7.D X12.3
NetK7_G: K7.G R38.2 R41.2
NetK8_G: K8.G R38.1 R42.2
NetR34_1: R34.1 R36.2 S2.1(A)
NetR35_1: R35.1 R37.2 S2.3(B)
NetR38_5: R38.5 U11.4(LED3)
NetR38_6: R38.6 U11.3(LED2)
NetR38_7: R38.7 U11.2(LED1)
NetR38_8: R38.8 U11.1(LED0)
NetU5_80: U11.6(SCL) ; port I2C.SCL
NetU5_82: U11.7(SDA) ; port I2C.SDA

Not connected (* = marked no-connect by the designer): X13 3*; X14 3*; X15 3*; X16 3*

### Notes on the sheet
- (near S2) Rotary Encoder
- Changed to 2.2nF
- Schmitt-Trigger Buffer
- Matching Connector:
  Phoenix Contact (1778874)
- RGB Power Button
- DC-Fan Connectros
- (near U11) PWM-Driver
- (near U11) I²C Address: 0x62
- Fan Type:
  Startech FAN7X10TX3
  70 x 70 x 11 mm
- Title
- Author:
- Subtitle
- Date:
- Rev:
- File:
- Sheet
- of

### Library data of the parts
C46 C50 = C-CAPACITOR: CAP-MK; Component Description: Multilayer Ceramic Capacitors; Component Value: 1µF 50V; Digikey: 1276-1860-1-ND; Farnell: 3013383; Mouser: 187-CL10A105KB8NNNC; JLC-Parts: C15849; Unit Price: 0.01
C47-C49 = C-CAPACITOR: CAP-MK; Component Description: Multilayer Ceramic Capacitors; Component Value: 10nF 50V; Digikey: 445-5662-1-ND; Farnell: 2346966; Mouser: 77-VJ0603V103ZXAPBC; JLC-Parts: C57112; Unit Price: 0.01
C51-C54 = C-CAPACITOR: as C21-C24 on sheet Audio-Beamformer_FPGA_V1.0; Digikey: 445-7886-1-ND; Farnell: 2211092; Mouser: 810-CGA5L3X5R1H106K; JLC-Parts: C13585; Unit Price: 0.27
D16 = R-DIODE: DIODE (alt V); Component Description: Fast Switching Diode; Component Value: 1N4148WTR; Digikey: 1655-1360-1-ND; Farnell: 2306363; Mouser: 750-1N4148W-HF; ComponentLink1Description: Datasheet; ComponentLink1URL: https://datasheet.lcsc.com/lcsc/1811061725_ST-Semtech-1N4148W_C81598.pdf; JLC-Parts: C81598; Unit Price: 0.01
K5-K8 = K-FET:NIGE: MOSFET N-Channel; Digikey: 785-1000-1-ND; ComponentLink1Description: Datasheet; ComponentLink1URL: http://www.aosmd.com/pdfs/datasheet/AO3400A.pdf; Component Description: MOSFET N-Channel; Component Value: AO3400A; JLC-Parts: C20917; Unit Price: 0.20
R33-R37 R39-R42 = R-RESISTOR: RES (E=Heizwiderstand B=Messwandler); Component Description: Thick Film Chip Resistor; Component Value: 10k (75V, 100mW, 1%); Digikey: P10.0KHCT-ND; Farnell: 2303192; Mouser: 667-ERJ-3EKF1002V; JLC-Parts: C25804; Unit Price: 0.01
R38 = R-Array Single Quad E24 - 330: Isolated Resistor Array; Component Value: 100 (4x, 50V, 62.5mW, 5%); ComponentLink1Description: Datasheet; ComponentLink1URL: https://datasheet.lcsc.com/lcsc/1810170717_UNI-ROYAL-Uniroyal-Elec-4D03WGJ0331T5E_C12018.pdf; Digikey: Y4101CT-ND; Farnell: 2060157; JLC-Parts: C25506; Mouser: 667-EXB-V8V101JV; Unit Price: 0.01; Component Description: Isolated Resistor Array
S2 = S-Rotary Encoder: Rotary Encoder; Component Description: Rotary Encoder with Switch; Digikey: PEC11R-4025F-S0024; Mouser: 652-PEC11R4025FS0024; ComponentLink1Description: Datasheet; ComponentLink1URL: https://www.bourns.com/docs/Product-Datasheets/PEC11R.pdf; Component Value: PEC11R-4025F-S0024; Unit Price: 2.49
U10 = U-SN74LVC3G17DCTR: Tripple Schmitt-Trigger Buffer; Digikey: 296-16915-1-ND; Farnell: 595-SN74LVC3G17DCTR; Mouser: 595-SN74LVC3G17DCTR; Component Description: Tripple Schmitt-Trigger Buffer; ComponentLink1Description: Datasheet; ComponentLink1URL: https://datasheet.lcsc.com/lcsc/1809081631_Texas-Instruments-SN74LVC3G17DCTR_C18213.pdf; Component Value: SN74LVC3G17DCTR; JLC-Parts: C18213; Unit Price: 0.70
U11 = U-PCA9633DP1: I2C Quad LED-Driver; Digikey: 568-3236-1-ND; Farnell: 2759862; Mouser: 771-PCA9633DP1-T; Component Description: I2C Quad LED-Driver; ComponentLink1Description: Datasheet; ComponentLink1URL: https://datasheet.lcsc.com/lcsc/1806132321_NXP-Semicon-PCA9633DP1-118_C88381.pdf; Component Value: PCA9633DP1; JLC-Parts: C88381; Unit Price: 1.45
X12 = X-Stiftleiste (6-Fach): Component Value: PTSM 0,5/ 6-HH-2,5-THR R32; Digikey: 277-2312-1-ND; Farnell: 3240578; Mouser: 651-1778667; Component Description: Board-To-Wire Connector (Receptacle); ComponentLink1Description: Datasheet; ComponentLink1URL: https://4donline.ihs.com/images/VipMasterIC/IC/PCON/PCONS21961/PCONS22028-1.pdf?hkey=52A5661711E402568146F3353EA87419; Unit Price: 1.42
X13-X16 = X-Stiftleiste (3-Fach): Component Description: Board-To-Wire Connector (Receptacle); Component Value: 61900311021; Digikey: 732-2700-ND; Farnell: 1841372; Mouser: 710-61900311021; ComponentLink1Description: Datasheet; ComponentLink1URL: https://www.farnell.com/datasheets/2977292.pdf; Unit Price: 0.58

## Nets that join several sheets
5V: Audio-Beamformer_Supply_V1.0 (8 pins), Audio-Beamformer_LED_V1.0 (80 pins), Audio-Beamformer_RaspberryPi_V1.0 (8 pins), Audio-Beamformer_USB_V1.0 (F1.2), Audio-Beamformer_HDMI_V1.0 (X6.18 X7.18), Audio-Beamformer_Sensors_V1.0 (C96.2 U14.4), FPGA (12 pins), FPGA (12 pins), Audio-Beamformer_HMI_V1.0 (X12.6)
12V: Row-Driver1 (6 pins), Row-Driver2 (6 pins), Row-Driver3 (6 pins), Row-Driver4 (6 pins), Row-Driver5 (6 pins), Row-Driver6 (6 pins), Row-Driver7 (6 pins), Row-Driver8 (6 pins), Row-Driver9 (6 pins), Row-Driver10 (6 pins), Row-Driver11 (6 pins), Row-Driver12 (6 pins), Row-Driver13 (6 pins), Row-Driver14 (6 pins), Row-Driver15 (6 pins), Row-Driver16 (6 pins), Row-Driver17 (6 pins), Row-Driver18 (6 pins), Row-Driver19 (6 pins), Audio-Beamformer_Supply_V1.0 (6 pins), Audio-Beamformer_HMI_V1.0 (9 pins)
A14: Row-Driver1 (14 pins), Row-Driver2 (14 pins), Row-Driver3 (14 pins), Row-Driver4 (14 pins), Row-Driver5 (14 pins), Row-Driver6 (14 pins), Row-Driver7 (14 pins), Row-Driver8 (14 pins), Row-Driver9 (14 pins), Row-Driver10 (14 pins), Row-Driver11 (14 pins), Row-Driver12 (14 pins), Row-Driver13 (14 pins), Row-Driver14 (14 pins), Row-Driver15 (14 pins), Row-Driver16 (14 pins), Row-Driver17 (14 pins), Row-Driver18 (14 pins), Row-Driver19 (14 pins), Audio-Beamformer_Supply_V1.0 (25 pins), Audio-Beamformer_LED_V1.0 (83 pins), Audio-Beamformer_RaspberryPi_V1.0 (57 pins), Audio-Beamformer_USB_V1.0 (37 pins), Audio-Beamformer_HDMI_V1.0 (12 pins), Audio-Beamformer_Sensors_V1.0 (10 pins), FPGA (38 pins), FPGA (36 pins), Audio-Beamformer_HMI_V1.0 (23 pins)
A17: Audio-Beamformer_Supply_V1.0 (C15.2 R6.2 U4.8), Audio-Beamformer_RaspberryPi_V1.0 (8 pins), Audio-Beamformer_USB_V1.0 (19 pins), Audio-Beamformer_Sensors_V1.0 (8 pins), FPGA (X2_2.17), Audio-Beamformer_HMI_V1.0 (7 pins)
HV: Row-Driver1 (6 pins), Row-Driver2 (6 pins), Row-Driver3 (6 pins), Row-Driver4 (6 pins), Row-Driver5 (6 pins), Row-Driver6 (6 pins), Row-Driver7 (6 pins), Row-Driver8 (6 pins), Row-Driver9 (6 pins), Row-Driver10 (6 pins), Row-Driver11 (6 pins), Row-Driver12 (6 pins), Row-Driver13 (6 pins), Row-Driver14 (6 pins), Row-Driver15 (6 pins), Row-Driver16 (6 pins), Row-Driver17 (6 pins), Row-Driver18 (6 pins), Row-Driver19 (6 pins), Audio-Beamformer_Supply_V1.0 (6 pins)
A2: Audio-Beamformer_RaspberryPi_V1.0 (TP15.1 U5.49), FPGA (X2_1.2), FPGA (X2_2.2)
A3: Audio-Beamformer_RaspberryPi_V1.0 (TP17.1 U5.26), FPGA (X2_1.3), FPGA (X2_2.3)
A5: Audio-Beamformer_RaspberryPi_V1.0 (TP19.1 U5.25), FPGA (X2_1.5), FPGA (X2_2.5)
A6: Audio-Beamformer_RaspberryPi_V1.0 (TP16.1 U5.39), FPGA (X2_1.6), FPGA (X2_2.6)
A8: Audio-Beamformer_RaspberryPi_V1.0 (TP18.1 U5.38), FPGA (X2_1.8), FPGA (X2_2.8)
A9: Audio-Beamformer_RaspberryPi_V1.0 (TP20.1 U5.44), FPGA (X2_1.9)
A11: Audio-Beamformer_V1.0 (TP1.1), FPGA (X2_2.11)
A11: FPGA (X2_1.11), FPGA (X2_2.9)
A12: Audio-Beamformer_RaspberryPi_V1.0 (TP11.1 U5.50), FPGA (X2_1.12), FPGA (X2_2.12)
A14: Audio-Beamformer_V1.0 (R1.1), FPGA (X2_2.14)
B20: Row-Driver10 (R14_10.1), FPGA (X3_1.20)
B21: Row-Driver10 (R12_10.1), FPGA (X3_1.21)
B23: Row-Driver9 (R14_9.1), FPGA (X3_1.23)
B23: Row-Driver19 (R14_19.1), FPGA (X3_2.23)
B24: Row-Driver9 (R12_9.1), FPGA (X3_1.24)
B24: Row-Driver19 (R12_19.1), FPGA (X3_2.24)
B27: Row-Driver8 (R14_8.1), FPGA (X3_1.27)
B27: Row-Driver18 (R14_18.1), FPGA (X3_2.27)
B28: Row-Driver8 (R12_8.1), FPGA (X3_1.28)
B28: Row-Driver18 (R12_18.1), FPGA (X3_2.28)
B30: Row-Driver7 (R14_7.1), FPGA (X3_1.30)
B30: Row-Driver17 (R14_17.1), FPGA (X3_2.30)
B31: Row-Driver7 (R12_7.1), FPGA (X3_1.31)
B31: Row-Driver17 (R12_17.1), FPGA (X3_2.31)
B33: Row-Driver6 (R14_6.1), FPGA (X3_1.33)
B33: Row-Driver16 (R14_16.1), FPGA (X3_2.33)
B34: Row-Driver6 (R12_6.1), FPGA (X3_1.34)
B34: Row-Driver16 (R12_16.1), FPGA (X3_2.34)
B36: Row-Driver5 (R14_5.1), FPGA (X3_1.36)
B36: Row-Driver15 (R14_15.1), FPGA (X3_2.36)
B37: Row-Driver5 (R12_5.1), FPGA (X3_1.37)
B37: Row-Driver15 (R12_15.1), FPGA (X3_2.37)
B39: Row-Driver4 (R14_4.1), FPGA (X3_1.39)
B39: Row-Driver14 (R14_14.1), FPGA (X3_2.39)
B40: Row-Driver4 (R12_4.1), FPGA (X3_1.40)
B40: Row-Driver14 (R12_14.1), FPGA (X3_2.40)
B42: Row-Driver3 (R14_3.1), FPGA (X3_1.42)
B42: Row-Driver13 (R14_13.1), FPGA (X3_2.42)
B43: Row-Driver3 (R12_3.1), FPGA (X3_1.43)
B43: Row-Driver13 (R12_13.1), FPGA (X3_2.43)
B45: Row-Driver2 (R14_2.1), FPGA (X3_1.45)
B45: Row-Driver12 (R14_12.1), FPGA (X3_2.45)
B46: Row-Driver2 (R12_2.1), FPGA (X3_1.46)
B46: Row-Driver12 (R12_12.1), FPGA (X3_2.46)
B48: Row-Driver1 (R14_1.1), FPGA (X3_1.48)
B48: Row-Driver11 (R14_11.1), FPGA (X3_2.48)
B49: Row-Driver1 (R12_1.1), FPGA (X3_1.49)
B49: Row-Driver11 (R12_11.1), FPGA (X3_2.49)
D39: Audio-Beamformer_RaspberryPi_V1.0 (TP14.1 U5.100), Audio-Beamformer_USB_V1.0 (U9.26), FPGA (X5_1.39), FPGA (X5_2.39)
D40: Audio-Beamformer_V1.0 (R1.2), FPGA (X5_1.40)
D40: Audio-Beamformer_V1.0 (TP2.1), FPGA (X5_2.40)
ENC_A: Audio-Beamformer_RaspberryPi_V1.0 (U5.31), Audio-Beamformer_HMI_V1.0 (U10.5)
ENC_B: Audio-Beamformer_RaspberryPi_V1.0 (U5.29), Audio-Beamformer_HMI_V1.0 (U10.2)
ENC_S: Audio-Beamformer_RaspberryPi_V1.0 (U5.27), Audio-Beamformer_HMI_V1.0 (U10.7)
HDMI0_CEC: Audio-Beamformer_RaspberryPi_V1.0 (U5.151), Audio-Beamformer_HDMI_V1.0 (X6.13)
HDMI0_CK_N: Audio-Beamformer_RaspberryPi_V1.0 (U5.190), Audio-Beamformer_HDMI_V1.0 (X6.12)
HDMI0_CK_P: Audio-Beamformer_RaspberryPi_V1.0 (U5.188), Audio-Beamformer_HDMI_V1.0 (X6.10)
HDMI0_D0_N: Audio-Beamformer_RaspberryPi_V1.0 (U5.184), Audio-Beamformer_HDMI_V1.0 (X6.9)
HDMI0_D0_P: Audio-Beamformer_RaspberryPi_V1.0 (U5.182), Audio-Beamformer_HDMI_V1.0 (X6.7)
HDMI0_D1_N: Audio-Beamformer_RaspberryPi_V1.0 (U5.178), Audio-Beamformer_HDMI_V1.0 (X6.6)
HDMI0_D1_P: Audio-Beamformer_RaspberryPi_V1.0 (U5.176), Audio-Beamformer_HDMI_V1.0 (X6.4)
HDMI0_D2_N: Audio-Beamformer_RaspberryPi_V1.0 (U5.172), Audio-Beamformer_HDMI_V1.0 (X6.3)
HDMI0_D2_P: Audio-Beamformer_RaspberryPi_V1.0 (U5.170), Audio-Beamformer_HDMI_V1.0 (X6.1)
HDMI0_HPLG: Audio-Beamformer_RaspberryPi_V1.0 (U5.153), Audio-Beamformer_HDMI_V1.0 (X6.19)
HDMI0_SCL: Audio-Beamformer_RaspberryPi_V1.0 (U5.200), Audio-Beamformer_HDMI_V1.0 (X6.15)
HDMI0_SDA: Audio-Beamformer_RaspberryPi_V1.0 (U5.199), Audio-Beamformer_HDMI_V1.0 (X6.16)
HDMI1_CEC: Audio-Beamformer_RaspberryPi_V1.0 (U5.149), Audio-Beamformer_HDMI_V1.0 (X7.13)
HDMI1_CK_N: Audio-Beamformer_RaspberryPi_V1.0 (U5.166), Audio-Beamformer_HDMI_V1.0 (X7.12)
HDMI1_CK_P: Audio-Beamformer_RaspberryPi_V1.0 (U5.164), Audio-Beamformer_HDMI_V1.0 (X7.10)
HDMI1_D0_N: Audio-Beamformer_RaspberryPi_V1.0 (U5.160), Audio-Beamformer_HDMI_V1.0 (X7.9)
HDMI1_D0_P: Audio-Beamformer_RaspberryPi_V1.0 (U5.158), Audio-Beamformer_HDMI_V1.0 (X7.7)
HDMI1_D1_N: Audio-Beamformer_RaspberryPi_V1.0 (U5.154), Audio-Beamformer_HDMI_V1.0 (X7.6)
HDMI1_D1_P: Audio-Beamformer_RaspberryPi_V1.0 (U5.152), Audio-Beamformer_HDMI_V1.0 (X7.4)
HDMI1_D2_N: Audio-Beamformer_RaspberryPi_V1.0 (U5.148), Audio-Beamformer_HDMI_V1.0 (X7.3)
HDMI1_D2_P: Audio-Beamformer_RaspberryPi_V1.0 (U5.146), Audio-Beamformer_HDMI_V1.0 (X7.1)
HDMI1_HPLG: Audio-Beamformer_RaspberryPi_V1.0 (U5.143), Audio-Beamformer_HDMI_V1.0 (X7.19)
HDMI1_SCL: Audio-Beamformer_RaspberryPi_V1.0 (U5.147), Audio-Beamformer_HDMI_V1.0 (X7.15)
HDMI1_SDA: Audio-Beamformer_RaspberryPi_V1.0 (U5.145), Audio-Beamformer_HDMI_V1.0 (X7.16)
HV_EN: Audio-Beamformer_Supply_V1.0 (R9.2), Audio-Beamformer_RaspberryPi_V1.0 (TP10.1 U5.48)
NetU5_80: Audio-Beamformer_RaspberryPi_V1.0 (U5.80), Audio-Beamformer_Sensors_V1.0 (U13.4 U15.1 U16.1 X18.2), Audio-Beamformer_HMI_V1.0 (U11.6)
NetU5_82: Audio-Beamformer_RaspberryPi_V1.0 (U5.82), Audio-Beamformer_Sensors_V1.0 (U13.3 U15.6 U16.6 X18.3), Audio-Beamformer_HMI_V1.0 (U11.7)
PWR_SW: Audio-Beamformer_RaspberryPi_V1.0 (U5.54 U5.56), Audio-Beamformer_HMI_V1.0 (X12.2)
SPI4_CE1: Audio-Beamformer_Supply_V1.0 (R6.1 U4.1), Audio-Beamformer_RaspberryPi_V1.0 (TP21.1 U5.41)
SPI4_MOSI: Audio-Beamformer_Supply_V1.0 (U4.3), Audio-Beamformer_RaspberryPi_V1.0 (TP25.1 U5.30)
SPI4_SCLK: Audio-Beamformer_Supply_V1.0 (U4.2), Audio-Beamformer_RaspberryPi_V1.0 (TP23.1 U5.37)
SPI5_MOSI: Audio-Beamformer_LED_V1.0 (R44.2 U12.3), Audio-Beamformer_RaspberryPi_V1.0 (TP24.1 U5.55)
SPI5_SCLK: Audio-Beamformer_LED_V1.0 (R43.2 U12.1), Audio-Beamformer_RaspberryPi_V1.0 (TP22.1 U5.51)
USB_CAM_N: Audio-Beamformer_USB_V1.0 (U9.1), Audio-Beamformer_Sensors_V1.0 (U14.2)
USB_CAM_P: Audio-Beamformer_USB_V1.0 (U9.2), Audio-Beamformer_Sensors_V1.0 (U14.3)
USB_N: Audio-Beamformer_RaspberryPi_V1.0 (U5.103), Audio-Beamformer_USB_V1.0 (U8.6)
USB_OTG: Audio-Beamformer_RaspberryPi_V1.0 (U5.101), Audio-Beamformer_USB_V1.0 (R24.1 R25.1 TP26.1 U8.1)
USB_P: Audio-Beamformer_RaspberryPi_V1.0 (U5.105), Audio-Beamformer_USB_V1.0 (U8.4)